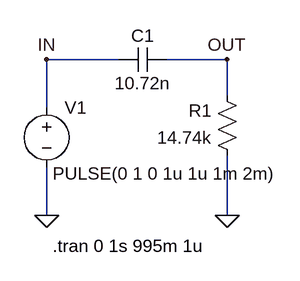
[diagram p0: schematic 1-2_Differentiating_circuit.asc]
1-2_Differentiating_circuit.asc, the LTspice schematic file:
Version 4.1
SHEET 1 880 680
WIRE -32 48 -128 48
WIRE 112 48 32 48
WIRE 112 96 112 48
WIRE -128 112 -128 48
WIRE -128 256 -128 192
WIRE 112 256 112 176
FLAG 112 256 0
FLAG -128 256 0
FLAG -128 48 IN
FLAG 112 48 OUT
SYMBOL res 128 192 R180
WINDOW 0 36 76 Left 2
WINDOW 3 36 40 Left 2
SYMATTR InstName R1
SYMATTR Value 14.74k
SYMBOL cap 32 32 R90
WINDOW 0 0 32 VBottom 2
WINDOW 3 32 32 VTop 2
SYMATTR InstName C1
SYMATTR Value 10.72n
SYMBOL voltage -128 96 R0
WINDOW 3 8 104 Left 2
WINDOW 123 0 0 Left 0
WINDOW 39 0 0 Left 0
SYMATTR Value PULSE(0 1 0 1u 1u 1m 2m)
SYMATTR InstName V1
TEXT -120 296 Left 2 !.tran 0 1s 995m 1u

The netlist it stands for:
* 1-2_Differentiating_circuit.asc
R1 0 OUT 14.74k
C1 OUT IN 10.72n
V1 IN 0 PULSE(0 1 0 1u 1u 1m 2m)
.tran 0 1s 995m 1u
.backanno
.end